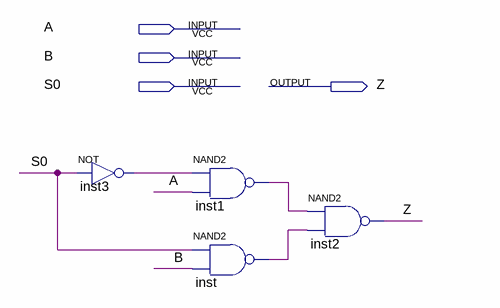
[diagram p0: schematic sheet]
// Quartus schematic mux2_1.bdf as structural Verilog: 4 symbols, 4 pins
module mux2_1 (
  input  A,
  input  B,
  input  S0,
  output Z
);

  wire inst1_out, inst3_out, inst_out;

  not inst3 (inst3_out, S0);
  nand inst1 (inst1_out, inst3_out, A);
  nand inst (inst_out, S0, B);
  nand inst2 (Z, inst1_out, inst_out);
endmodule
